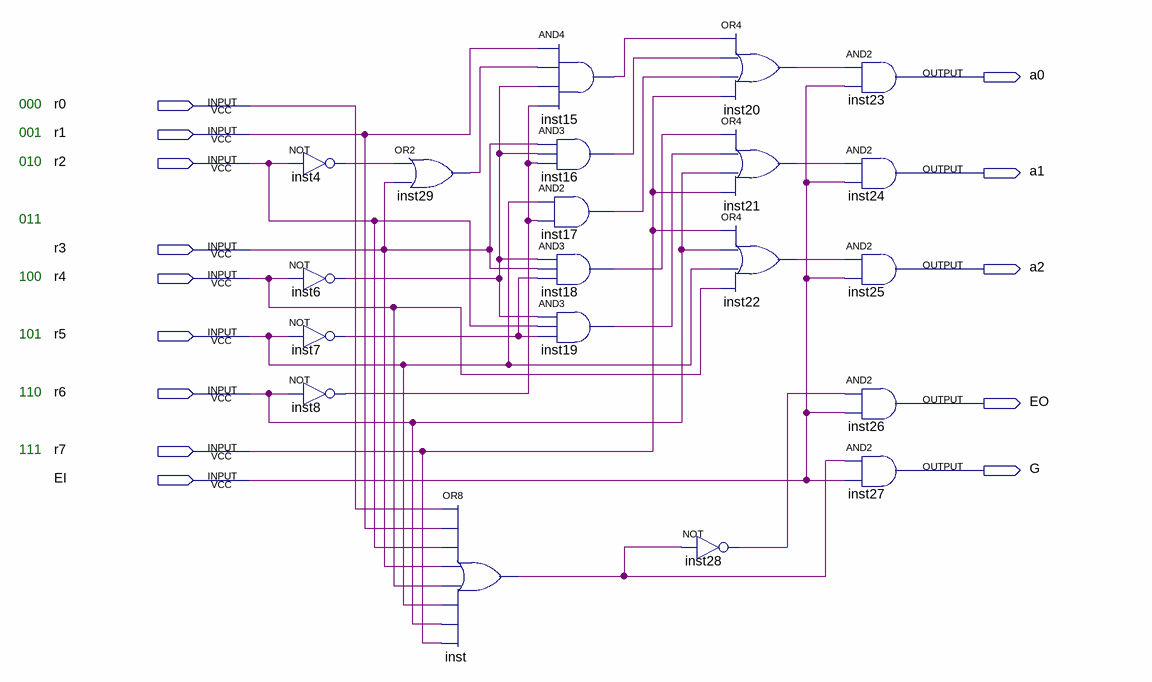
[diagram p0: schematic sheet]
// Quartus schematic cip8_3g.bdf as structural Verilog: 20 symbols, 14 pins
module cip8_3g (
  input  r0,
  input  r1,
  input  r2,
  input  r3,
  input  r4,
  input  r5,
  input  r6,
  input  r7,
  input  EI,
  output a0,
  output a1,
  output a2,
  output EO,
  output G
);

  wire inst4_out, inst6_out, inst7_out, inst8_out, inst15_out, inst16_out, inst17_out, inst18_out,
       inst19_out, inst20_out, inst21_out, inst22_out, inst28_out, inst29_out, inst_out;

  not inst4 (inst4_out, r2);
  not inst6 (inst6_out, r4);
  not inst7 (inst7_out, r5);
  not inst8 (inst8_out, r6);
  or inst29 (inst29_out, inst4_out, r3);
  or inst (inst_out, r0, r1, r2, r3, r4, r5, r6, r7);
  and inst15 (inst15_out, r1, inst29_out, inst6_out, inst8_out);
  and inst16 (inst16_out, r3, inst6_out, inst8_out);
  and inst17 (inst17_out, r5, inst8_out);
  and inst18 (inst18_out, inst6_out, r3, inst7_out);
  and inst19 (inst19_out, inst6_out, r2, inst7_out);
  or inst20 (inst20_out, inst15_out, inst16_out, inst17_out, r7);
  or inst21 (inst21_out, inst18_out, inst19_out, r6, r7);
  or inst22 (inst22_out, r7, r6, r5, r4);
  not inst28 (inst28_out, inst_out);
  and inst23 (a0, inst20_out, EI);
  and inst24 (a1, inst21_out, EI);
  and inst25 (a2, inst22_out, EI);
  and inst26 (EO, inst28_out, EI);
  and inst27 (G, inst_out, EI);

  // Notes on the sheet:
  //   000
  //   001
  //   010
  //   011
  //   100
  //   101
  //   110
  //   111
endmodule
